# EAGLE design C1G14-BreakoutTH (EAGLE 9.6.2)
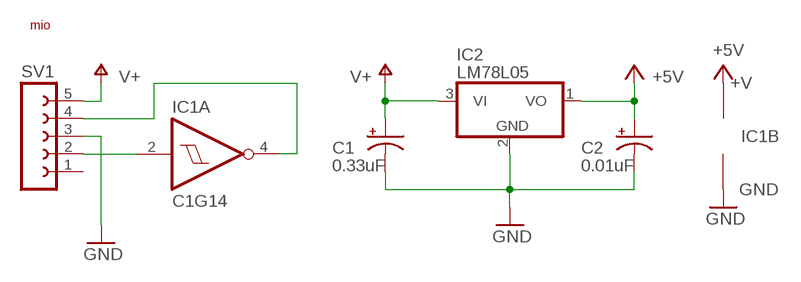
[diagram p0: schematic, sheet 1]

## Parts
C1  0.33uF  CPOL-USE2.5-6  [E2,5-6]
C2  0.01uF  CPOL-USE2.5-6  [E2,5-6]
IC1  C1G14  [SOT-25]
IC2  LM78L05  [LM78LXX]
SV1  FE05-1  [FE05-1]
U$2  MIO  [MIO]

## Nets
+5V: C2.+ IC1.5(B:V+) IC2.1(VO)
GND: C1.- C2.- IC1.3(B:GND) IC2.2(GND) SV1.3
N$1: IC1.2(A:A) SV1.2
N$2: IC1.4(A:Y) SV1.4
V+: C1.+ IC2.3(VI) SV1.5
Unconnected: SV1.1

## Library data of the parts
C1 C2 = rcl:CPOL-US: POLARIZED CAPACITOR, American symbol; SPICEPREFIX: C
IC1 = wb-logic:C1G14
IC2 = wb-power:LM78L05
SV1 = con-lsta:FE05-1: FEMALE HEADER; OC_FARNELL: unknown; OC_NEWARK: unknown
U$2 = wb-art:MIO

## Board
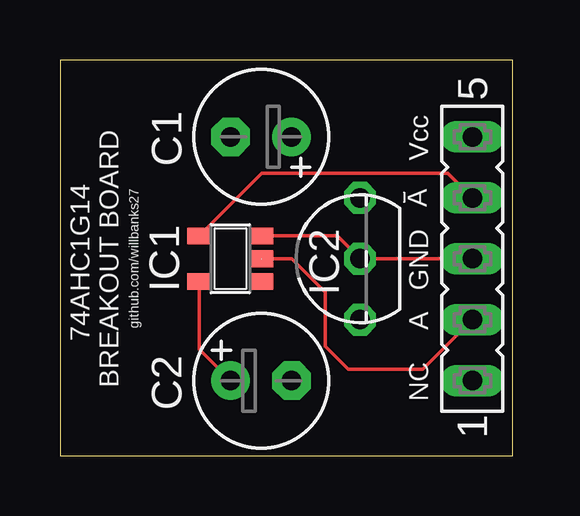
[diagram p1: board, top side]
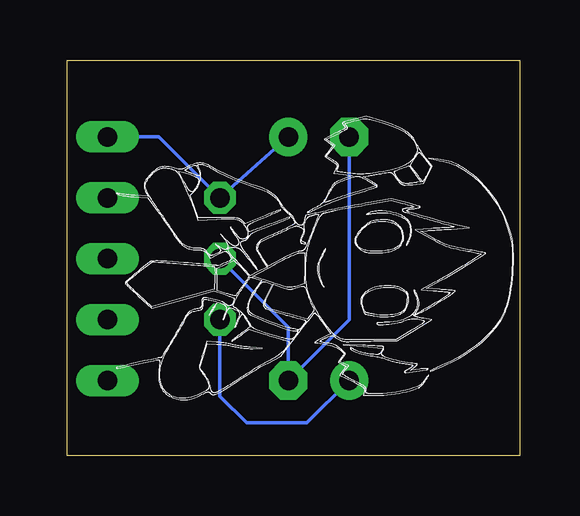
[diagram p2: board, bottom side, seen from below]

Size 18.86 x 16.48 mm. Coordinates in mm from the lower left corner, seen from the top.
Outline: 0,0 18.86,0 18.86,16.48 0,16.48 0,0
Copper layers (1*16): Top 0.035mm / dielectric 1.5mm / Bottom 0.035mm
Design rules "default": minimum track width 6mil, minimum drill 0.35mm, track to track 6mil, track to pad 6mil, pad to pad 6mil, via to via 6mil, smd to smd 6mil, copper to edge 40mil, drill to drill 6mil, minimum pad ring 10mil, minimum via ring 8mil, stop-mask expansion 4mil, vias tented up to drill 0mil, thermal gap 10mil

### Footprints (pad centres in the part's own frame; a part is rotated, then mirrored left to right if it is on the bottom)
E2,5-6 = drill 0.813 pad 1.6: + -1.27,0 | drill 0.813 pad 1.6 octagon: - 1.27,0
SOT-25 = smd 0.69 x 0.99: 1 -0.95,-1.29; 2 0,-1.29; 3 0.95,-1.29; 4 0.95,1.3; 5 -0.95,1.3
LM78LXX = drill 0.813 octagon: 1 -2.54,0; 2 0,0; 3 2.54,0
FE05-1 = drill 0.813 long: 1 -5.08,0; 2 -2.54,0; 3 0,0; 4 2.54,0; 5 5.08,0

### Placement (x,y rotation side)
C1  8.38,13.28 180 top
C2  0.33uF  [E2,5-6]  8.38,3.12 0 top
IC1  7.1,8.2 90 top
IC2  12.5,8.2 90 top
SV1  17.18,8.2 90 top
U$2  9.2,7.62 270 bottom

### Tracks (layer width: path | path; a pad name or v marks a point on that pad's centre or on a via)
+5V
  Top 0.152: C2.+ 5.8,4.43 IC1.5
  Bottom 0.152: C2.+ 8.87,1.36 11.38,1.36 12.5,2.48 IC2.1
GND
  Top 0.152: IC1.3 11.55,9.15 IC2.2 SV1.3
  Bottom 0.152: IC2.2 9.65,5.35 C2.- 7.11,5.66 C1.-
N$1
  Top 0.152: IC1.2 9.66,8.2 11.06,6.8 11.06,4.56 12.02,3.6 15.12,3.6 SV1.2
N$2
  Top 0.152: IC1.4 8.41,11.76 16.16,11.76 SV1.4
V+
  Bottom 0.152: C1.+ IC2.3 15.04,13.28 SV1.5

### Text on the board
tPlace: Vcc | A | 74AHC1G14 / BREAKOUT BOARD | github.com/willbanks27 | GND | A | NC